# Altium schematic sheet 04-POWER.SchDoc
size A4
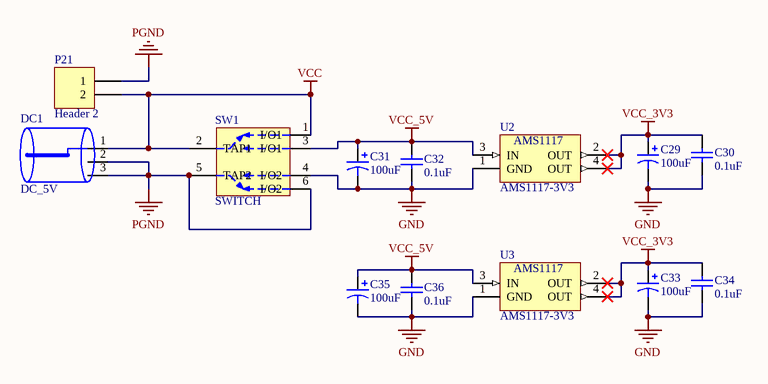
[diagram p0: 04-POWER.SchDoc]

## Parts
C29  100uF  [C_SMD(6.3x5.3)]
C30  0.1uF  [0603C]
C31  100uF  [C_SMD(6.3x5.3)]
C32  0.1uF  [0603C]
C33  100uF  [C_SMD(6.3x5.3)]
C34  0.1uF  [0603C]
C35  100uF  [C_SMD(6.3x5.3)]
C36  0.1uF  [0603C]
DC1  DC_5V  [DC_POWER]
P21  Header 2  [KF2EDG_3R81_2P]
SW1  SWITCH  [SW-8R5X8R5]
U2  AMS1117-3V3  [SOT223]
U3  AMS1117-3V3  [SOT223]

## Nets
GND: C29.2 C30.1 C31.2 C32.1 C33.2 C34.1 C35.2 C36.1 SW1.4(I/O2) U2.1(GND) U3.1(GND)
PGND: DC1.2(VCC) DC1.3(VCC) P21.1 SW1.5(TAP2) SW1.6(I/O2)
VCC: DC1.1(VCC) P21.2 SW1.1(I/O1) SW1.2(TAP1)
VCC_3V3: C29.1 C30.2 C33.1 C34.2 U2.2(OUT) U2.4(OUT) U3.2(OUT) U3.4(OUT)
VCC_5V: C31.1 C32.2 C35.1 C36.2 SW1.3(I/O1) U2.3(IN) U3.3(IN)

## Notes on the sheet
- (in symbol AMS1117-3v3) AMS1117

## Library data of the parts
C29 C31 C33 C35 = Cap Pol1: Polarized Capacitor (Radial); Published: 8-Jun-2000; LatestRevisionDate: 17-Jul-2002; LatestRevisionNote: Re-released for DXP Platform.; PackageReference: RB7.6-15; Publisher: Altium Limited; PackageDescription: Polarized Capacitor (Radial); 2 Leads; Value: 100uF
C30 C32 C34 C36 = Cap: Capacitor; Published: 8-Jun-2000; LatestRevisionDate: 17-Jul-2002; LatestRevisionNote: Re-released for DXP Platform.; PackageReference: RAD-0.3; Publisher: Altium Limited; PackageDescription: Radial Cap, Thru-Hole; 2 Leads; 0.3 in Pin Spacing; Value: 0.1uF
DC1 = DC_5V: DC005; Manufacturer: TruConnect; Manufacturer Part Number: K-DC-0052.5; Mount: Socket
P21 = Header 2: Header, 2-Pin; LatestRevisionDate: 17-Jul-2002; LatestRevisionNote: Re-released for DXP Platform.; Publisher: Altium Limited